# Altium schematic sheet DI_ch.SchDoc
size A4
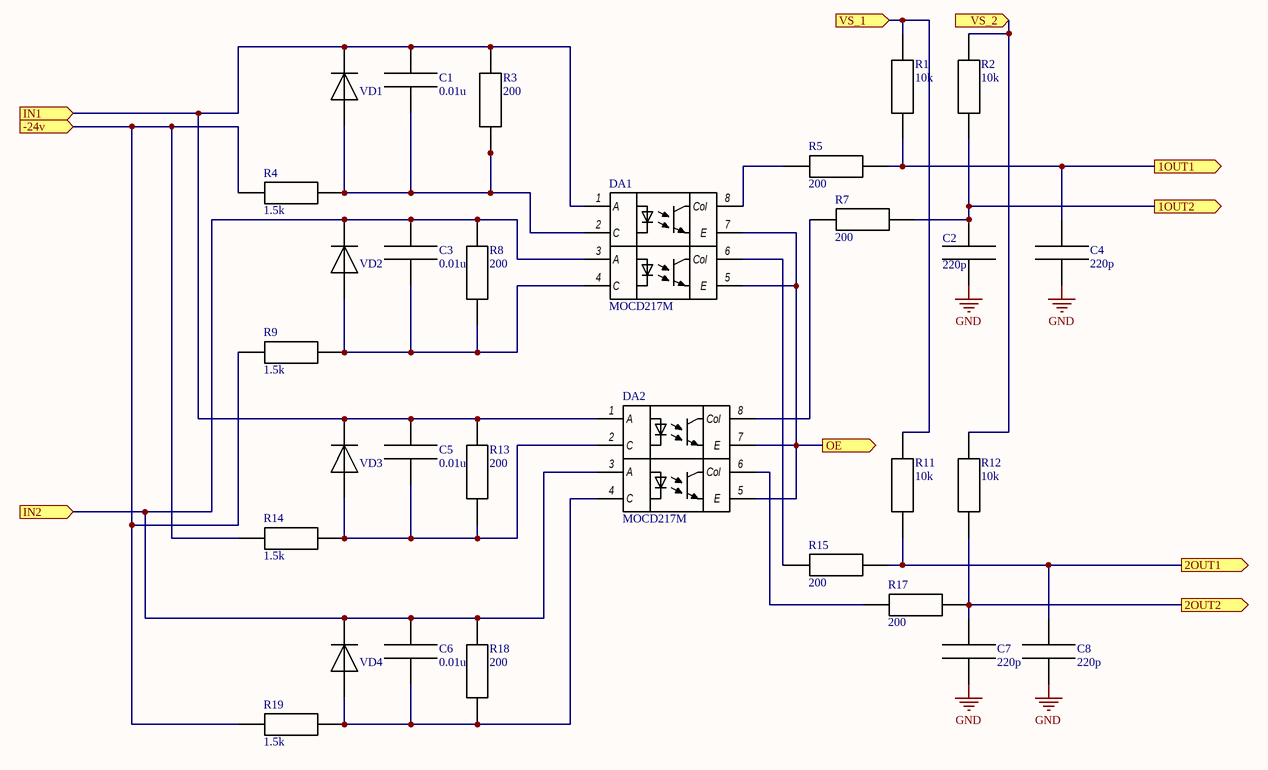
[diagram p0: DI_ch.SchDoc]

## Parts
C1  0.01u  [0603_cap]
C2  220p  [cap_0402]
C3  0.01u  [0603_cap]
C4  220p  [cap_0402]
C5  0.01u  [0603_cap]
C6  0.01u  [0603_cap]
C7  220p  [cap_0402]
C8  220p  [cap_0402]
DA1  MOCD217M  [SO-8_optocup]
DA2  MOCD217M  [SO-8_optocup]
R1  10k  [res_0402]
R2  10k  [res_0402]
R3  200  [0603_res]
R4  1.5k  [2512_res]
R5  200  [res_0402]
R7  200  [res_0402]
R8  200  [0603_res]
R9  1.5k  [2512_res]
R11  10k  [res_0402]
R12  10k  [res_0402]
R13  200  [0603_res]
R14  1.5k  [2512_res]
R15  200  [res_0402]
R17  200  [res_0402]
R18  200  [0603_res]
R19  1.5k  [2512_res]
VD1  1N4448  [sod-323]  (value not drawn)
VD2  1N4448  [sod-323]  (value not drawn)
VD3  1N4448  [sod-323]  (value not drawn)
VD4  1N4448  [sod-323]  (value not drawn)

## Ports
1OUT1 (out), 1OUT2 (out), 2OUT1 (out), 2OUT2 (out), -24v (in), IN1 (in), IN2 (in), OE (out), VS_1 (in), VS_2 (in)

## Nets
GND: C2.1 C4.1 C7.1 C8.1
1OUT1: C4.2 R1.1 R5.1 ; port 1OUT1
1OUT2: C2.2 R2.1 R7.1 ; port 1OUT2
2OUT1: C8.2 R11.1 R15.1 ; port 2OUT1
2OUT2: C7.2 R12.1 R17.1 ; port 2OUT2
-24v: R4.1 R9.1 R14.1 R19.1 ; port -24v
IN1: C1.2 C5.2 DA1.1(A) DA2.1(A) R3.2 R13.2 VD1.K VD3.K ; port IN1
IN2: C3.2 C6.2 DA1.3(A) DA2.3(A) R8.2 R18.2 VD2.K VD4.K ; port IN2
OE: DA1.5(E) DA1.7(E) DA2.5(E) DA2.7(E) ; port OE
VS_1: R1.2 R11.2 ; port VS_1
VS_2: R2.2 R12.2 ; port VS_2
NetC1_1: C1.1 DA1.2(C) R3.1 R4.2 VD1.A
NetC3_1: C3.1 DA1.4(C) R8.1 R9.2 VD2.A
NetC5_1: C5.1 DA2.2(C) R13.1 R14.2 VD3.A
NetC6_1: C6.1 DA2.4(C) R18.1 R19.2 VD4.A
NetDA1_6: DA1.6(Col) R15.2
NetDA1_8: DA1.8(Col) R5.2
NetDA2_6: DA2.6(Col) R17.2
NetDA2_8: DA2.8(Col) R7.2

## Library data of the parts
C1-C8 = cap
DA1 DA2 = MOCD217M: dual optopair
R1-R5 R7-R9 R11-R15 R17-R19 = res